# EAGLE design driver (EAGLE 7.1.0)
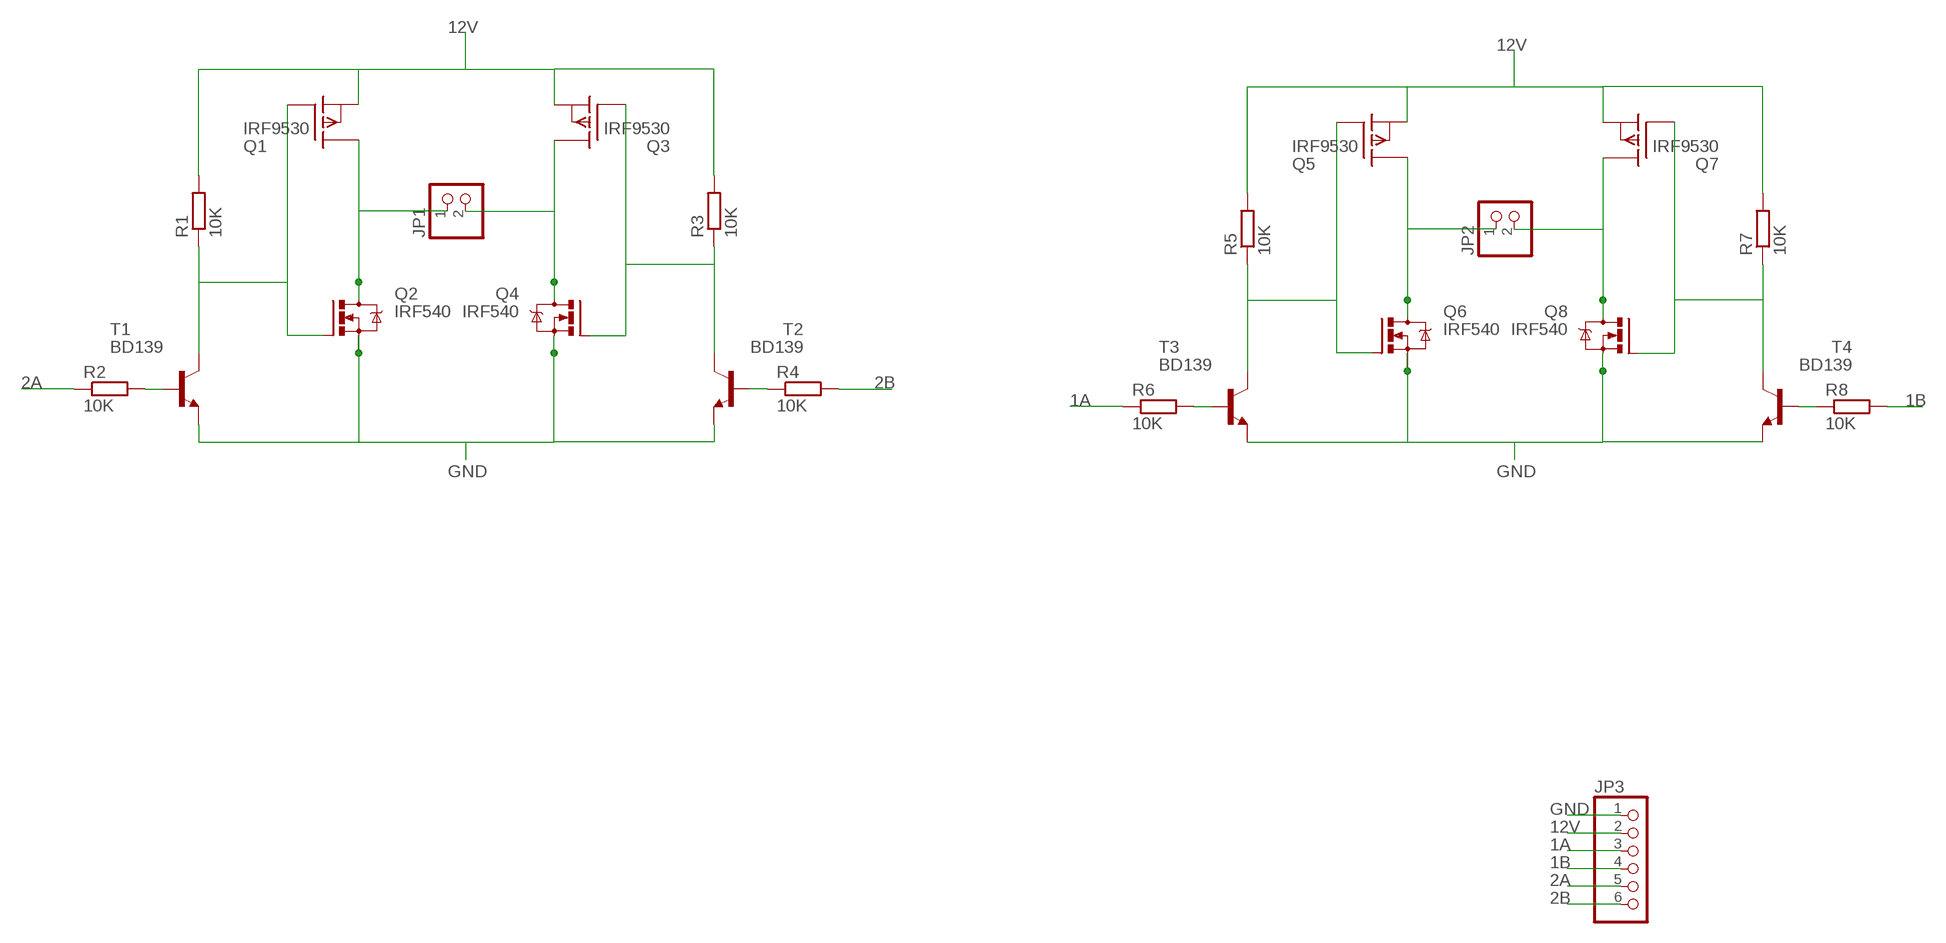
[diagram p0: schematic, sheet 1]

## Parts
JP1  PINHD-1X2  [1X02]
JP2  PINHD-1X2  [1X02]
JP3  PINHD-1X6  [1X06]
Q1  IRF9530  [TO220]
Q2  IRF540  [TO220BV]
Q3  IRF9530  [TO220]
Q4  IRF540  [TO220BV]
Q5  IRF9530  [TO220]
Q6  IRF540  [TO220BV]
Q7  IRF9530  [TO220]
Q8  IRF540  [TO220BV]
R1  10K  R-EU_0207/7  [0207/7]
R2  10K  R-EU_0207/7  [0207/7]
R3  10K  R-EU_0207/7  [0207/7]
R4  10K  R-EU_0207/7  [0207/7]
R5  10K  R-EU_0207/7  [0207/7]
R6  10K  R-EU_0207/7  [0207/7]
R7  10K  R-EU_0207/7  [0207/7]
R8  10K  R-EU_0207/7  [0207/7]
T1  BD139  [TO126]
T2  BD139  [TO126]
T3  BD139  [TO126]
T4  BD139  [TO126]

## Nets
1A: JP3.3 R6.1
1B: JP3.4 R8.2
2A: JP3.5 R2.1
2B: JP3.6 R4.2
12V: JP3.2 Q1.3(S) Q3.3(S) Q5.3(S) Q7.3(S) R1.2 R3.2 R5.2 R7.2
GND: JP3.1 Q2.S Q4.S Q6.S Q8.S T1.1(E) T2.1(E) T3.1(E) T4.1(E)
N$1: JP1.1 Q1.2(D) Q2.D
N$2: JP1.2 Q3.2(D) Q4.D
N$6: JP2.1 Q5.2(D) Q6.D
N$7: R2.2 T1.3(B)
N$8: R4.1 T2.3(B)
N$9: Q3.1(G) Q4.G R3.1 T2.2(C)
N$10: Q1.1(G) Q2.G R1.1 T1.2(C)
N$11: JP2.2 Q7.2(D) Q8.D
N$17: R8.1 T4.3(B)
N$19: R6.2 T3.3(B)
N$20: Q5.1(G) Q6.G R5.1 T3.2(C)
N$21: Q7.1(G) Q8.G R7.1 T4.2(C)

## Library data of the parts
JP1 JP2 = pinhead:PINHD-1X2: PIN HEADER
JP3 = pinhead:PINHD-1X6: PIN HEADER
Q1 Q3 Q5 Q7 = transistor-fet:IRF9530: P-Channel Enhancement MOSFET (HEXFET); -100V; -12A; 0,3Ohm
Q2 Q4 Q6 Q8 = transistor-power:IRF540: HEXFET Power MOSFET
R1-R8 = rcl:R-EU_: RESISTOR, European symbol
T1-T4 = transistor:BD139: NPN TRANSISTOR

## Board
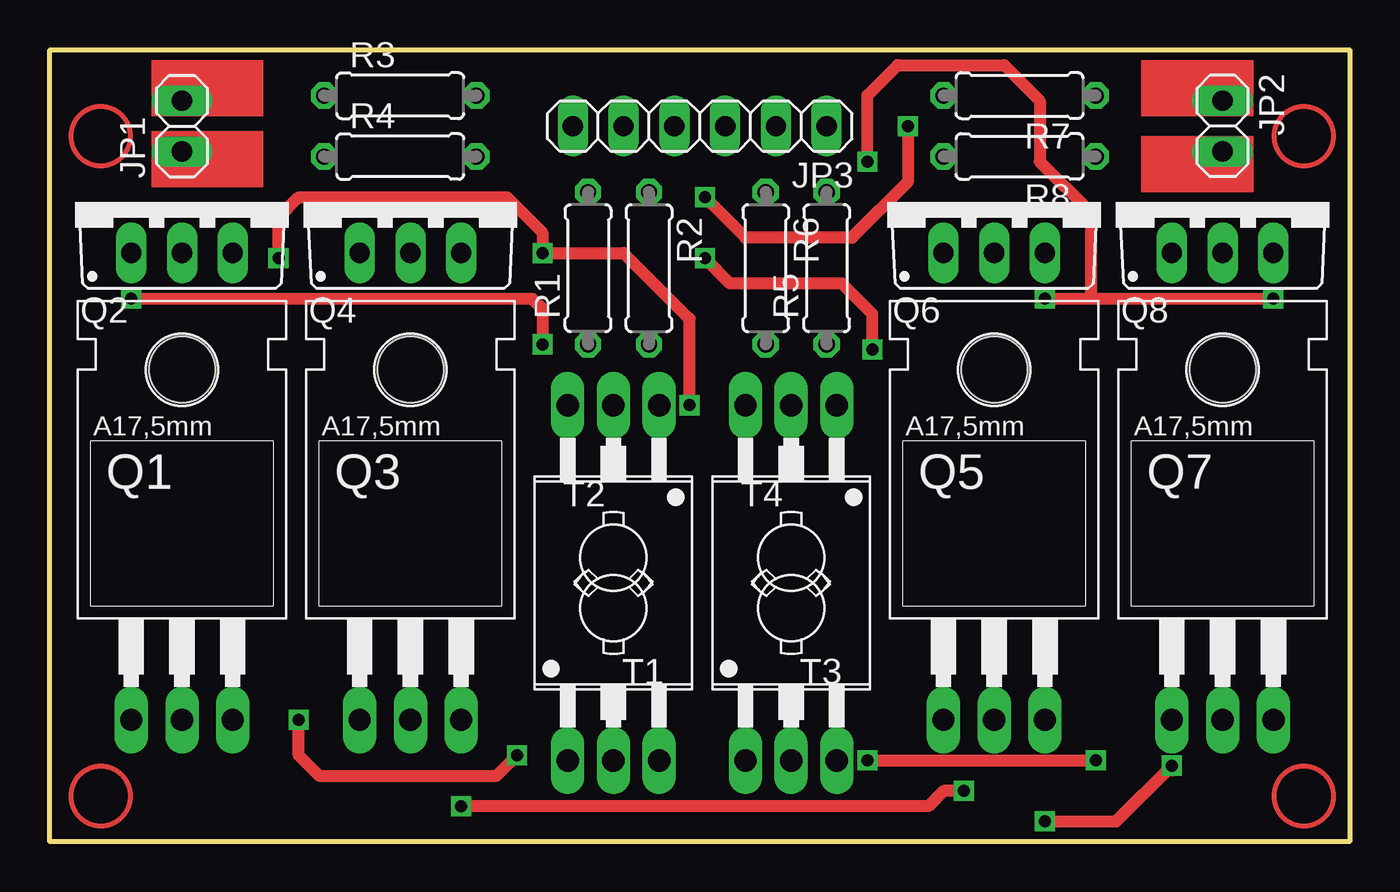
[diagram p1: board, top side]
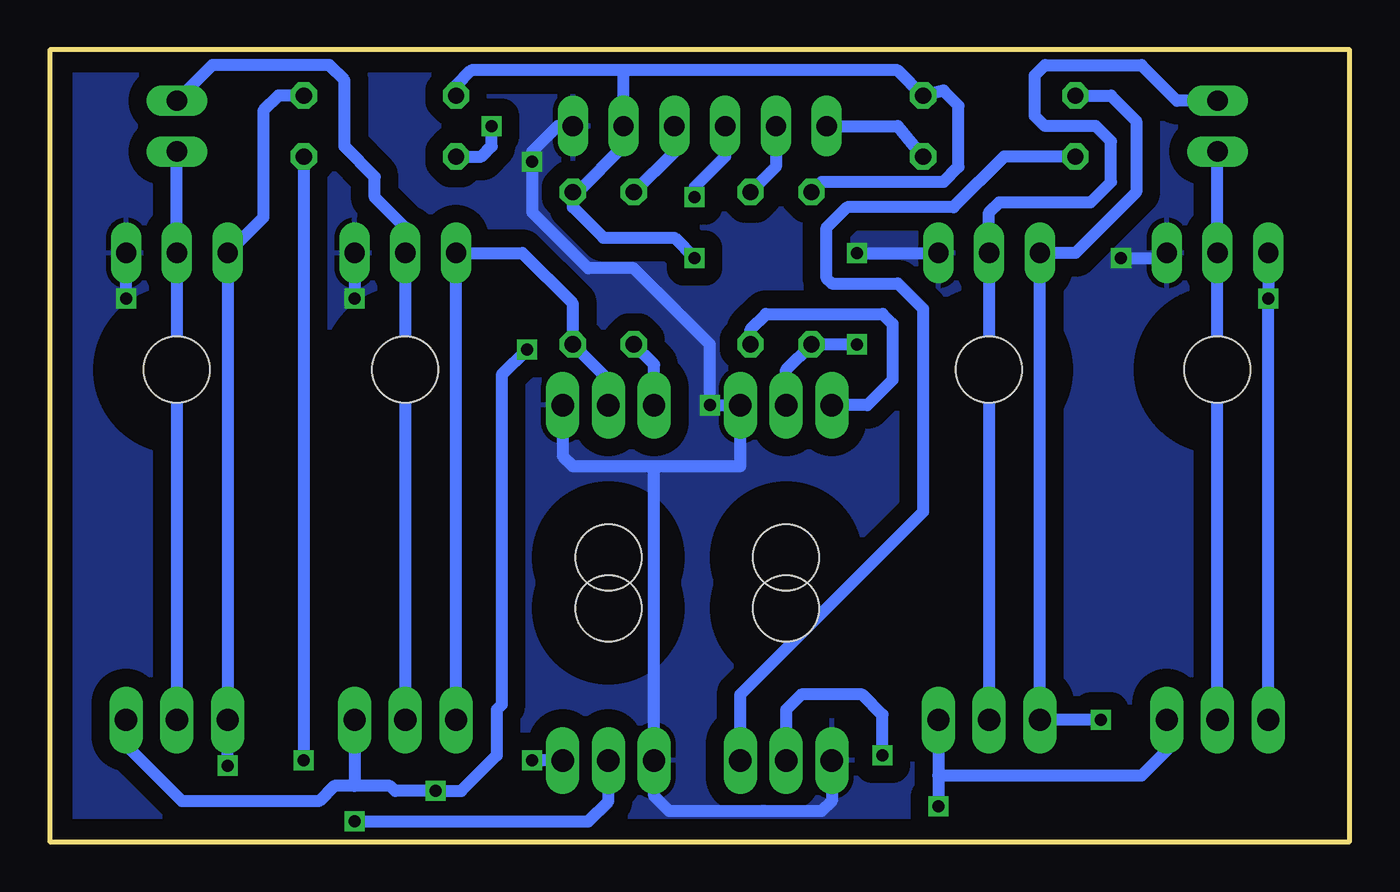
[diagram p2: board, bottom side, seen from below]

Size 65.02 x 39.62 mm. Coordinates in mm from the lower left corner, seen from the top.
Outline: 0,39.62 65.02,39.62 65.02,0 0,0 0,39.62
Copper layers (1*16): Top 0.035mm / dielectric 1.5mm / Bottom 0.035mm
Design rules "default *": minimum track width 10mil, minimum drill 24mil, track to track 35mil, track to pad 35mil, pad to pad 8mil, via to via 8mil, smd to smd 8mil, copper to edge 40mil, drill to drill 8mil, minimum pad ring 10mil, minimum via ring 8mil, stop-mask expansion 4mil, vias tented up to drill 0mil, thermal gap 10mil

### Footprints (pad centres in the part's own frame; a part is rotated, then mirrored left to right if it is on the bottom)
1X02 = drill 1.016 long: 1 -1.27,0; 2 1.27,0
1X06 = drill 1.016 long: 1 -6.35,0; 2 -3.81,0; 3 -1.27,0; 4 1.27,0; 5 3.81,0; 6 6.35,0
TO220 = drill 1.118 long: 1 -2.54,-6.35; 2 0,-6.35; 3 2.54,-6.35 | hole 3.302: 0,11.176
TO220BV = drill 1.016 long: D 0,-2.54; G -2.54,-2.54; S 2.54,-2.54
0207/7 = drill 0.813 octagon: 1 -3.81,0; 2 3.81,0
TO126 = drill 1.118 long: 1 -2.286,-5.08; 2 0,-5.08; 3 2.286,-5.08 | hole 3.302: 0,5.08

### Placement (x,y rotation side)
JP1  6.6,35.81 90 top
JP2  58.67,35.81 270 top
JP3  32.51,35.81 180 top
Q1  6.6,12.45 0 top
Q2  6.6,32 0 top
Q3  18.03,12.45 0 top
Q4  18.03,32 0 top
Q5  47.24,12.45 0 top
Q6  47.24,32 0 top
Q7  58.67,12.45 0 top
Q8  58.67,32 0 top
R1  26.92,28.7 90 top
R2  29.97,28.7 270 top
R3  17.53,37.34 0 top
R4  17.53,34.29 0 top
R5  38.86,28.7 90 top
R6  35.81,28.7 270 top
R7  48.51,37.34 180 top
R8  48.51,34.29 180 top
T1  28.19,16.76 180 top
T2  28.19,9.14 0 top
T3  37.08,16.76 180 top
T4  37.08,9.14 0 top

### Tracks (layer width: path | path; a pad name or v marks a point on that pad's centre or on a via)
1A
  Bottom 0.61: R6.1 33.78,34.54 JP3.3
1B  (via drill 0.6)
  Top 0.61: v42.93,35.81 42.93,33.02 40.13,30.23 34.8,30.23 v32.77,32.26
  Bottom 0.61: R8.2 43.43,34.29 42.93,34.8 v42.93,35.81 | JP3.4 31.24,34.29 32.77,32.77 v32.77,32.26
2A
  Bottom 0.61: JP3.5 28.7,33.78 R2.1
2B
  Bottom 0.61: JP3.6 22.61,35.81 R4.2
12V  (via drill 0.6)
  Top 0.61: v41.15,24.64 41.15,26.42 39.62,27.94 34.04,27.94 v32.77,29.21 | v45.72,2.54 44.7,2.54 43.94,1.78 v20.57,1.78
  Bottom 0.61: Q1.3 9.14,4.57 10.41,3.3 20.57,3.3 | R1.2 26.42,33.02 20.32,33.02 19.56,33.78 19.56,36.83 20.32,37.59 R3.2 22.61,38.61 36.32,38.61 | v41.15,24.64 42.42,23.37 42.42,6.86 42.67,6.6 42.67,4.32 44.45,2.54 v45.72,2.54 47.75,2.54 48.01,2.79 49.78,2.79 | Q3.3 20.57,3.3 | 20.57,3.3 v20.57,1.78 | 36.32,38.61 43.94,38.61 44.7,37.85 R7.2 | v32.77,29.21 33.78,30.23 37.34,30.23 38.86,31.75 R5.2 38.61,32.51 36.32,34.8 JP3.2 36.32,38.61 | Q7.3 61.21,4.83 58.42,2.03 51.56,2.03 50.8,2.79 49.78,2.79 | Q5.3 49.78,2.79
GND  (via drill 0.6)
  Top 0.61: v49.78,27.18 52.07,27.18 | 52.07,27.18 v61.21,27.18 | v11.43,29.21 11.43,31.24 12.45,32.26 22.86,32.26 24.64,30.48 v24.64,29.46 28.7,29.46 32,26.16 v32,21.84 | v40.89,34.04 40.89,37.34 42.42,38.86 47.75,38.86 49.53,37.08 49.53,34.04 52.07,31.5 52.07,27.18
  Bottom 0.61: v24.64,29.46 Q4.S | T3.1 39.37,19.3 38.86,18.8 35.05,18.8 | 35.05,18.8 30.48,18.8 T1.1 v32,21.84 32,24.89 35.81,28.7 38.1,28.7 40.89,31.5 v40.89,34.04 40.89,34.29 40.89,34.54 39.62,35.81 JP3.1 | 35.05,18.8 34.8,18.54 T4.1 34.8,2.29 34.04,1.52 26.42,1.52 25.91,2.03 T2.1 | Q6.S v49.78,27.18 | v61.21,27.18 Q8.S | v11.43,29.21 9.4,29.21 Q2.S
  pour Bottom: 0,39.62 65.02,39.62 65.02,0 0,0 0,39.37
N$1
  Bottom 0.61: Q1.2 Q2.D JP1.1
N$2
  Bottom 0.61: Q3.2 Q4.D 18.03,31.5 17.53,32 12.95,32 11.94,33.02 11.94,35.05 12.7,35.81 15.24,35.81 15.75,36.32 15.75,38.35 15.24,38.86 10.41,38.86 8.64,37.08 JP1.2
N$6
  Bottom 0.61: Q5.2 Q6.D 47.24,30.73 48.77,32.26 48.77,33.27 50.29,34.8 50.29,38.1 51.05,38.86 56.9,38.86 JP2.1
N$7
  Bottom 0.61: R2.2 29.97,25.65 29.21,26.42 23.37,26.42 22.86,25.91 22.86,23.11 24.13,21.84 T1.3
N$8
  Bottom 0.61: T2.3 30.48,7.37 21.34,16.51 21.34,26.67 22.61,27.94 25.91,27.94 26.16,28.19 26.16,30.73 25.15,31.75 19.81,31.75 17.27,34.29 R4.1
N$9  (via drill 0.6)
  Top 0.61: v12.45,6.1 12.45,4.32 13.46,3.3 22.35,3.3 v23.37,4.32
  Bottom 0.61: v12.45,6.1 Q3.1 Q4.G 13.72,29.46 10.67,32.51 10.67,36.07 11.94,37.34 R3.1 | v23.37,4.32 23.37,6.35 24.38,7.37 27.43,7.37 28.19,6.6 T2.2
N$10  (via drill 0.6)
  Top 0.61: v4.06,27.18 24.13,27.18 24.64,26.67 v24.64,24.89
  Bottom 0.61: Q1.1 v4.06,27.18 Q2.G | v24.64,24.89 R1.1 28.19,23.62 T1.2
N$11
  Bottom 0.61: Q7.2 Q8.D JP2.2
N$17  (via drill 0.6)
  Top 0.61: v40.89,4.06 v52.32,4.06
  Bottom 0.61: R8.1 v52.32,4.06 | T4.3 v40.89,4.06
N$19
  Bottom 0.61: T3.3 34.8,23.88 R6.2
N$20
  Bottom 0.61: Q5.1 Q6.G 41.4,29.46 38.86,26.92 R5.1 37.08,23.11 T3.2
N$21  (via drill 0.6)
  Top 0.61: 56.13,3.56 v56.13,3.81 53.34,1.02 v49.78,1.02
  Bottom 0.61: v56.13,3.81 Q7.1 Q8.G 54.36,31.24 54.36,36.58 53.59,37.34 R7.1 | v49.78,1.02 38.1,1.02 37.08,2.03 T4.2
(copper drawn outside any net)
  shapes: Top area x4, Top circle x4